# Altium schematic sheet ipmi.SchDoc: FMC SDR Transceiver Board
size 420 x 297 mm; CheckedBy: -; CompanyName: CERN; DrawnBy: DrawnBy; Organization: CERN; Address1: European Organization for Nuclear Research; Address2: CH-1211 Genčve 23 - Switzerland; Revision: -; SheetNumber: -; SheetTotal: -; EDA_Number: EDA-XXXXX-VX-X; Projet: -; ModifiedBy: -; CreateDate: XX/XX/XXXX; CheckedDate: -; Title2: FMC Management; DivGrp: TE/MPE; Designer: Designer; ModifiedDate: -
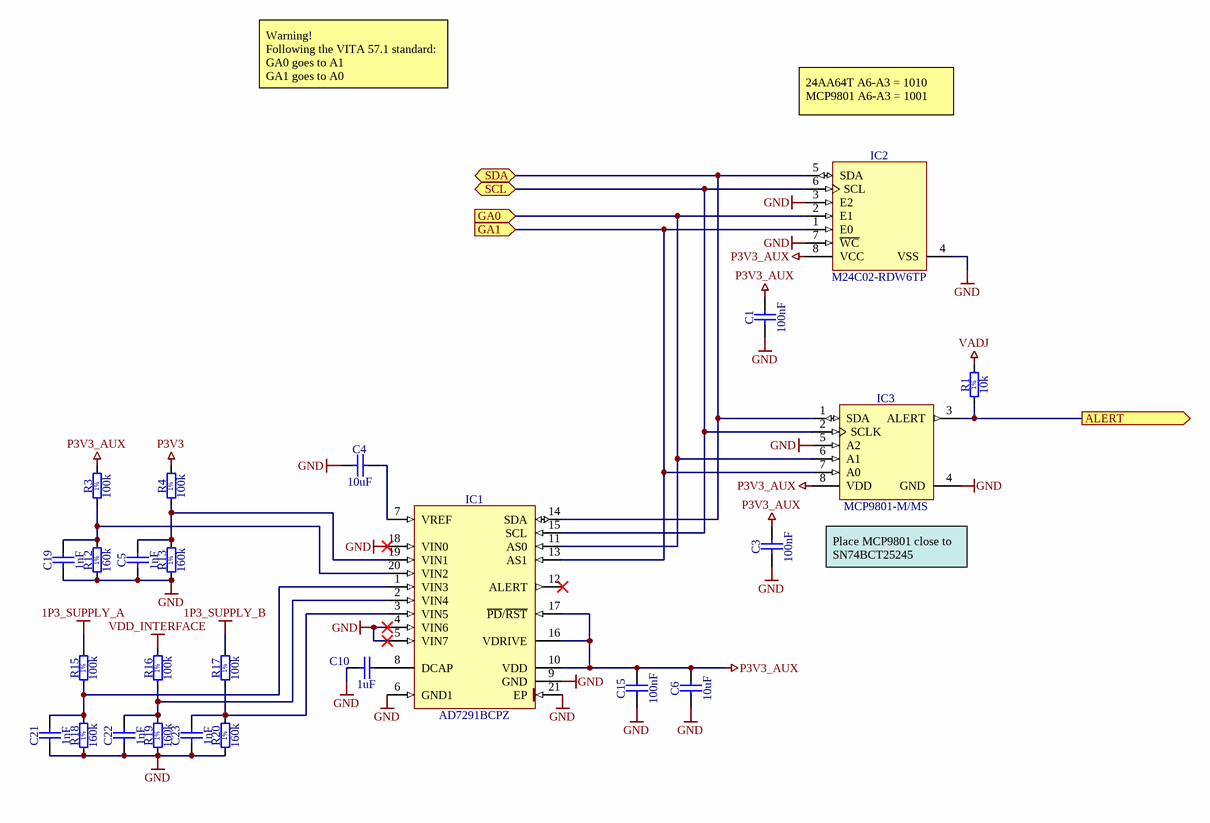
[diagram p0: ipmi.SchDoc]

## Parts
C1  100nF  [CAPC1005X55N]
C3  100nF  [CAPC1005X55N]
C4  10uF  [CAPC1608X87N]
C5  1nF  [CAPC1005X55N]
C6  10uF  [CAPC1608X87N]
C10  1uF  [CAPC1608X87N]
C15  100nF  [CAPC1005X55N]
C19  1nF  [CAPC1005X55N]
C21  1nF  [CAPC1005X55N]
C22  1nF  [CAPC1005X55N]
C23  1nF  [CAPC1005X55N]
IC1  AD7291BCPZ  [QFN50P400X400X80-21N-S275]
IC2  M24C02-RDW6TP  [SOP65P640X120-8N]
IC3  MCP9801-M/MS  [SOP65P490X110-8N]
R1  10k  [RESC1005X40N]
R3  100k  [RESC1005X40N]
R4  100k  [RESC1005X40N]
R12  160k  [RESC1005X40N]
R13  160k  [RESC1005X40N]
R15  100k  [RESC1005X40N]
R16  100k  [RESC1005X40N]
R17  100k  [RESC1005X40N]
R18  160k  [RESC1005X40N]
R19  160k  [RESC1005X40N]
R20  160k  [RESC1005X40N]

## Ports
ALERT (out), GA0 (in), GA1 (in), SCL (bidir), SDA (bidir)

## Nets
1P3_SUPPLY_A: R15.2
1P3_SUPPLY_B: R17.2
GND: C1.1 C3.1 C4.1 C5.1 C6.1 C10.1 C15.1 C19.1 C21.1 C22.1 C23.1 IC1.4(VIN6) IC1.5(VIN7) IC1.6(GND1) IC1.9(GND) IC1.18(VIN0) IC1.21(EP) IC2.3(E2) IC2.4(VSS) IC2.7(~{WC}) IC3.4(GND) IC3.5(A2) R12.1 R13.1 R18.1 R19.1 R20.1
P3V3: R4.2
P3V3_AUX: C1.2 C3.2 C6.2 C15.2 IC1.10(VDD) IC1.16(VDRIVE) IC1.17(~{PD}/~{RST}) IC2.8(VCC) IC3.8(VDD) R3.2
VADJ: R1.2
VDD_INTERFACE: R16.2
ALERT: IC3.3(ALERT) R1.1 ; port ALERT
GA0: IC1.11(AS0) IC2.2(E1) IC3.6(A1) ; port GA0
GA1: IC1.13(AS1) IC2.1(E0) IC3.7(A0) ; port GA1
SCL: IC1.15(SCL) IC2.6(SCL) IC3.2(SCLK) ; port SCL
SDA: IC1.14(SDA) IC2.5(SDA) IC3.1(SDA) ; port SDA
NetC4_2: C4.2 IC1.7(VREF)
NetC5_2: C5.2 IC1.19(VIN1) R4.1 R13.2
NetC10_2: C10.2 IC1.8(DCAP)
NetC19_2: C19.2 IC1.20(VIN2) R3.1 R12.2
NetC21_2: C21.2 IC1.1(VIN3) R15.1 R18.2
NetC22_2: C22.2 IC1.2(VIN4) R16.1 R19.2
NetC23_2: C23.2 IC1.3(VIN5) R17.1 R20.2

Not connected (* = marked no-connect by the designer): IC1 12(ALERT)*

## Notes on the sheet
- Warning!
  Following the VITA 57.1 standard:
  GA0 goes to A1
  GA1 goes to A0
- 24AA64T A6-A3 = 1010
  MCP9801 A6-A3 = 1001
- Place MCP9801 close to SN74BCT25245
- Project/Equipment
- Document
- Designer
- Drawn by
- Check.by
- File
- Last Mod.
- Print Date
- Sheet
- Size
- A3
- of
- Rev
- (in symbol R0402_10K_1%_0.0625W_100PPM) 1%
- (in symbol R0402_100K_1%_0.0625W_100PPM) 1%
- (in symbol R0402_160K_1%_0.0625W_100PPM) 1%

## Library data of the parts
C1 C3 C15 = CC0402_100NF_16V_10%_X7R: Non-polarised capacitor; Part Description: SMD Multilayer Chip Ceramic Capacitor; Manufacturer: GENERIC; Manufacturer1 Part Number: GRM155R71C104KA88D; Voltage: 16V; TC: X7R; Tolerance: ±10%; Part Number: CC0402_100NF_16V_10%_X7R; Component Kind: Standard; Component Type: Standard; Pin Count: 2; Value: 100nF; Status: Not Recommended; Manufacturer Part Number: CC0402_100NF_16V_10%_X7R; Case: 0402; Mounted: Yes; Socket: No; SMD: Yes; Sense: No; Manufacturer1 Example: MURATA; Manufacturer1 ComponentHeight: 0.55mm; HelpURL: \\cern.ch\dfs\Applications\Altium\Datasheets\CC0402_X7R_MURATA_GRM.pdf; Author: CERN DEM JLC; CreateDate: 05.12.2013; LatestRevisionDate: 03.12.2007
C4 C6 = CC0603_10UF_6.3V_20%_X5R: Non-polarised capacitor; Part Description: SMD Multilayer Chip Ceramic Capacitor; Manufacturer: GENERIC; Manufacturer1 Part Number: C0603C106M9PAC; Voltage: 6.3V; TC: X5R; Tolerance: ±20%; Part Number: CC0603_10UF_6.3V_20%_X5R; Component Kind: Standard; Component Type: Standard; Pin Count: 2; Value: 10uF; Status: Preferred; Manufacturer Part Number: CC0603_10uF_6.3V_20%_X5R; Case: 0603; Mounted: Yes; Socket: No; SMD: Yes; Sense: No; Manufacturer1 Example: KEMET; Manufacturer1 ComponentHeight: 0.95mm; HelpURL: \\cern.ch\dfs\Applications\Altium\Datasheets\CC0603_X5R_KEMET.pdf; Author: CERN DEM JLC; CreateDate: 03.12.2007; LatestRevisionDate: 03.12.2007
C5 C19 C21-C23 = CC0402_1NF_50V_10%_X7R: Non-polarised capacitor; Part Description: SMD Multilayer Chip Ceramic Capacitor; Manufacturer: GENERIC; Manufacturer1 Part Number: 223858715623; Voltage: 50V; TC: X7R; Tolerance: ±10%; Part Number: CC0402_1NF_50V_10%_X7R; Component Kind: Standard; Component Type: Standard; Pin Count: 2; Value: 1nF; Status: Not Recommended; Manufacturer Part Number: CC0402_1NF_50V_10%_X7R; Case: 0402; Mounted: Yes; Socket: No; SMD: Yes; Sense: No; Manufacturer1 Example: PHYCOMP; Manufacturer1 ComponentHeight: 0.55mm; HelpURL: \\cern.ch\dfs\Applications\Altium\Datasheets\CC0402_X7R_PHYCOMP.pdf; Author: CERN DEM JLC; CreateDate: 03.12.2007; LatestRevisionDate: 03.12.2007
C10 = CC0603_1UF_16V_10%_X7R: Non-polarised capacitor; Part Description: SMD Multilayer Chip Ceramic Capacitor; Manufacturer: GENERIC; Manufacturer1 Part Number: 223878615663; Voltage: 16V; TC: X7R; Tolerance: ±10%; Part Number: CC0603_1UF_16V_10%_X7R; Component Kind: Standard; Component Type: Standard; Pin Count: 2; Value: 1uF; Status: None; Manufacturer Part Number: CC0603_1uF_16V_10%_X7R; Case: 0603; Mounted: Yes; Socket: No; SMD: Yes; Sense: No; Manufacturer1 Example: YAGEO PHYCOMP; Manufacturer1 ComponentHeight: 0.9mm; HelpURL: \\cern.ch\dfs\Applications\Altium\Datasheets\CC0603_X7R_PHYCOMP.pdf; Author: CERN DEM JLC; CreateDate: 03.12.2007; LatestRevisionDate: 17.04.2015
IC1 = AD7291BCPZ: 8-Channel, I2C, 12-Bit SAR ADC with Temperature Sensor; Manufacturer: ANALOG DEVICES; PressFit: No; Bonding: No; Part Number: AD7291BCPZ; Component Kind: Standard; Component Type: Standard; Device: AD7291BCPZ; PackageDescription: QFN, 0.50mm Pitch, Square; 20 Pin, 4.00mm L X 4.00mm W X 0.80mm H Body (w/Thermal Tab 2.75 X 2.75mm),  IPC Medium Density; Part Description: 8-Channel, I2C, 12-Bit SAR ADC with Temperature Sensor; Manufacturer Part Number: AD7291BCPZ; Pin Count: 21; Case: QFN20; Mounted: Yes; Socket: No; SMD: Yes; Sense: No; ComponentHeight: 0.8mm; Author: CERN DEM JLC; HelpURL: \\cern.ch\dfs\Applications\Altium\Datasheets\AD7291BCPZ.pdf; CreateDate: 29.08.2017; LatestRevisionDate: 29.08.2017
IC2 = M24C02-RDW6TP: 2-Kbit (256 x 8bit) Serial I2C Bus EEPROM; Manufacturer: ST MICROELECTRONICS; PressFit: No; Bonding: No; Part Number: M24C02-RDW6TP; Component Kind: Standard; Component Type: Standard; Device: M24C02-RDW6TP; PackageDescription: SOP, 0.65mm pitch; 8 pin, 4.40mm W X 3.00mm L X 1.20mm H body, IPC Medium Density; Part Description: 2-Kbit (256 x 8bit) Serial I2C Bus EEPROM; Manufacturer Part Number: M24C02-RDW6TP; Pin Count: 8; Case: TSSOP8; Mounted: Yes; Socket: No; SMD: Yes; Sense: No; ComponentHeight: 1.2mm; HelpURL: \\cern.ch\dfs\Applications\Altium\Datasheets\M24C02-RDW6TP.pdf; Author: CERN DEM JLC; CreateDate: 30.08.2017; LatestRevisionDate: 30.08.2017
IC3 = MCP9801-M/MS: 2-Wire High-Accuracy Temperature Sensor; Manufacturer: MICROCHIP TECHNOLOGIY; Table: Sensors; Part Number: MCP9801-M/MS; Component Kind: Standard; Component Type: Standard; Designator: MCP9801-M/MS; Device: MCP9801-M/MS; PackageDescription: SOP, 0.65mm pitch; 8 pin, 3.00mm W X 3.00mm L X 1.10mm H body, IPC Medium Density; Part Description: 2-Wire High-Accuracy Temperature Sensor; Manufacturer Part Number: MCP9801-M/MS; Pin Count: 8; Case: MSOP8; Mounted: Yes; Socket: No; SMD: Yes; ComponentHeight: 1.1mm; Datasheet: \\cern.ch\dfs\Applications\Altium\Datasheets\MCP9801-M-MS.pdf; HelpURL: \\cern.ch\dfs\Applications\Altium\Datasheets\MCP9801-M-MS.pdf; Author: CERN DEM JLC; CreateDate: 11/18/2009; LatestRevisionDate: 11/18/2009
R1 = R0402_10K_1%_0.0625W_100PPM: Resistor - 1%; Part Description: General Purpose Thick Film Chip Resistor; Manufacturer: GENERIC; Manufacturer1 Part Number: 232270671003L; TC: ±100ppm/°C; PressFit: No; Part Number: R0402_10K_1%_0.0625W_100PPM; Component Kind: Standard; Component Type: Standard; Pin Count: 2; Value: 10k; Status: Not Recommended; Power: 0.0625W; Tolerance: ±1%; Manufacturer Part Number: R0402_10K_1%_0.0625W_100PPM; Case: 0402; Mounted: Yes; Sense: No; Socket: No; SMD: Yes; Manufacturer1 Example: YAGEO PHYCOMP; Manufacturer1 ComponentHeight: 0.4mm; HelpURL: \\cern.ch\dfs\Applications\Altium\Datasheets\R0402_Phycomp_RC0402.pdf; Author: CERN DEM JLC; CreateDate: 03.12.2007; LatestRevisionDate: 17.10.2012
R3 R4 R15-R17 = R0402_100K_1%_0.0625W_100PPM: Resistor - 1%; Part Description: General Purpose Thick Film Chip Resistor; Manufacturer: GENERIC; Manufacturer1 Part Number: 232270671004L; TC: ±100ppm/°C; PressFit: No; Part Number: R0402_100K_1%_0.0625W_100PPM; Component Kind: Standard; Component Type: Standard; Pin Count: 2; Value: 100k; Status: Not Recommended; Power: 0.0625W; Tolerance: ±1%; Manufacturer Part Number: R0402_100K_1%_0.0625W_100PPM; Case: 0402; Mounted: Yes; Sense: No; Socket: No; SMD: Yes; Manufacturer1 Example: YAGEO PHYCOMP; Manufacturer1 ComponentHeight: 0.4mm; HelpURL: \\cern.ch\dfs\Applications\Altium\Datasheets\R0402_Phycomp_RC0402.pdf; Author: CERN DEM JLC; CreateDate: 03.12.2007; LatestRevisionDate: 17.10.2012
R12 R13 R18-R20 = R0402_160K_1%_0.0625W_100PPM: Resistor - 1%; Part Description: General Purpose Thick Film Chip Resistor; Manufacturer: GENERIC; Manufacturer1 Part Number: 232270671604L; TC: ±100ppm/°C; PressFit: No; Part Number: R0402_160K_1%_0.0625W_100PPM; Component Kind: Standard; Component Type: Standard; Pin Count: 2; Value: 160k; Status: Not Recommended; Power: 0.0625W; Tolerance: ±1%; Manufacturer Part Number: R0402_160K_1%_0.0625W_100PPM; Case: 0402; Mounted: Yes; Sense: No; Socket: No; SMD: Yes; Manufacturer1 Example: YAGEO PHYCOMP; Manufacturer1 ComponentHeight: 0.4mm; HelpURL: \\cern.ch\dfs\Applications\Altium\Datasheets\R0402_Phycomp_RC0402.pdf; Author: CERN DEM JLC; CreateDate: 03.12.2007; LatestRevisionDate: 17.10.2012